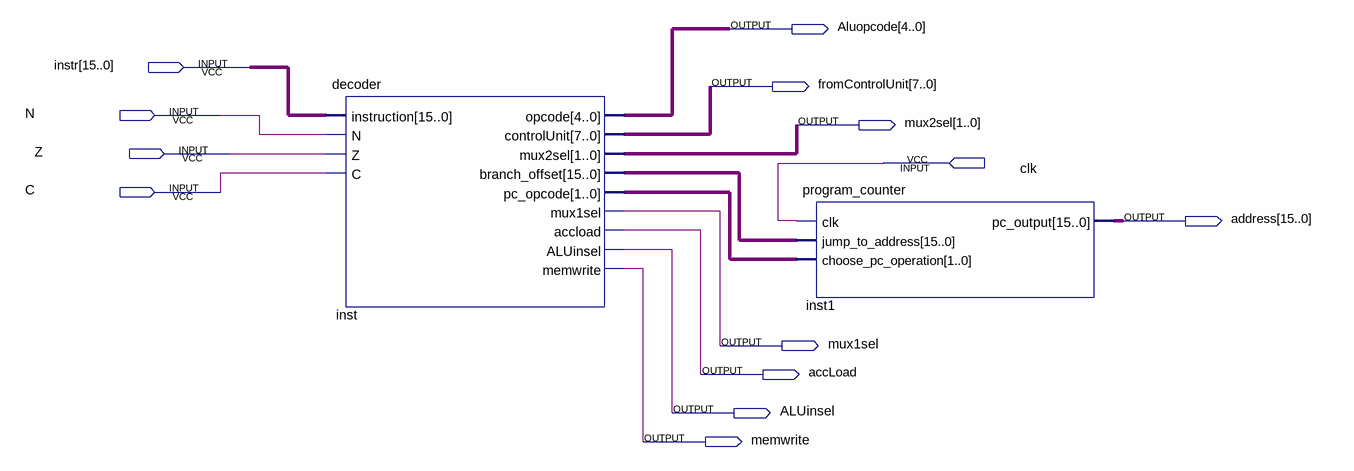
[diagram p0: schematic sheet]
// Quartus schematic controlunit.bdf as structural Verilog: 2 symbols, 13 pins
module controlunit (
  input  [15:0] instr,
  input  N,
  input  Z,
  input  clk,
  input  C,
  output [4:0] Aluopcode,
  output [7:0] fromControlUnit,
  output [1:0] mux2sel,
  output [15:0] address,
  output mux1sel,
  output accLoad,
  output ALUinsel,
  output memwrite
);

  wire [1:0] inst_pc_opcode;
  wire [15:0] inst_branch_offset;

  decoder inst (
    .instruction(instr), .N(N), .Z(Z), .C(C), .opcode(Aluopcode), .controlUnit(fromControlUnit),
    .mux2sel(mux2sel), .branch_offset(inst_branch_offset), .pc_opcode(inst_pc_opcode), .mux1sel(mux1sel),
    .accload(accLoad), .ALUinsel(ALUinsel), .memwrite(memwrite));
  program_counter inst1 (
    .clk(clk), .jump_to_address(inst_branch_offset), .choose_pc_operation(inst_pc_opcode), .pc_output(address));
endmodule
